# EAGLE schematic meArm (EAGLE 7.6.0)
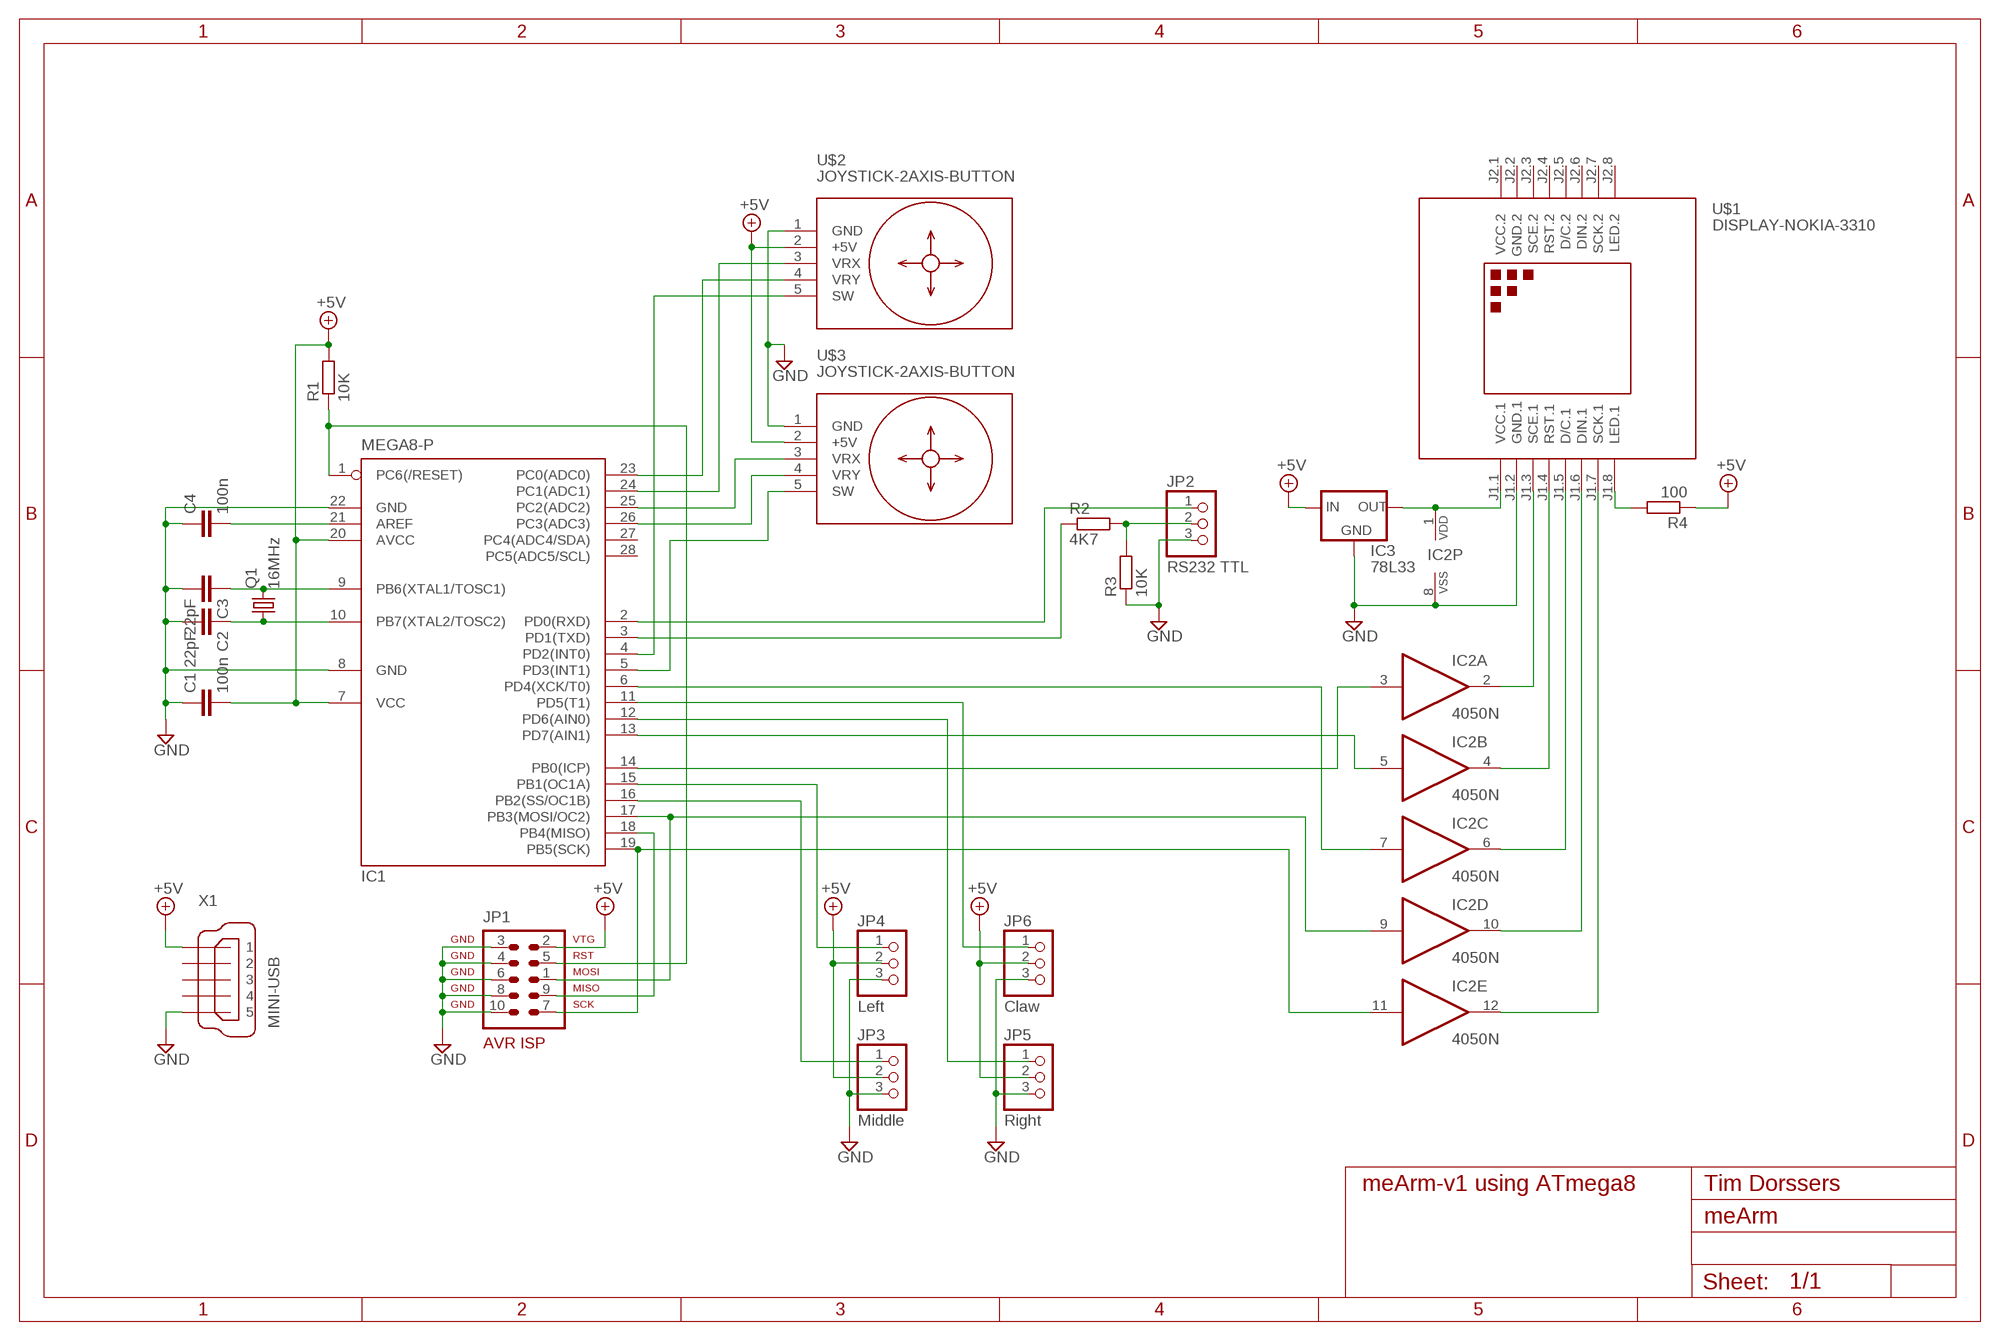
[diagram p0: schematic, sheet 1]

## Parts
C1  100n  C-EU025-025X050  [C025-025X050]
C2  22pF  C-EU025-024X044  [C025-024X044]
C3  22pF  C-EU025-024X044  [C025-024X044]
C4  100n  C-EU025-025X050  [C025-025X050]
IC1  MEGA8-P  [DIL28-3]
IC2  4050N  [DIL16]
IC3  78L33  78LXX  [78LXX]
JP1  AVR-ISP-10  [AVR-ISP-10]
JP2  RS232 TTL  PINHD-1X3  [1X03]
JP3  Middle  PINHD-1X3  [1X03]
JP4  Left  PINHD-1X3  [1X03]
JP5  Right  PINHD-1X3  [1X03]
JP6  Claw  PINHD-1X3  [1X03]
Q1  16MHz  CRYSTALHC49U-V  [HC49U-V]
R1  10K  R-EU_0204/7  [0204/7]
R2  4K7  R-EU_0204/7  [0204/7]
R3  10K  R-EU_0204/7  [0204/7]
R4  100  R-EU_0204/7  [0204/7]
U$1  DISPLAY-NOKIA-3310  [DISPLAY-NOKIA-3310]
U$2  JOYSTICK-2AXIS-BUTTON  [JOYSTICK-2AXIS-BUTTON]
U$3  JOYSTICK-2AXIS-BUTTON  [JOYSTICK-2AXIS-BUTTON]
X1  MINI-USB  MINI-USB_SHIELD5P2-32005-601  [32005-601]

## Nets
+5V: C1.2 IC1.7(VCC) IC1.20(AVCC) IC3.IN JP1.2 JP3.2 JP4.2 JP5.2 JP6.2 R1.2 R4.1 U$2.2(+5V) U$3.2(+5V) X1.1
GND: C1.1 C2.2 C3.2 C4.1 IC1.8(GND) IC1.22(GND) IC2.8(P:VSS) IC3.GND JP1.3 JP1.4 JP1.6 JP1.8 JP1.10 JP2.3 JP3.3 JP4.3 JP5.3 JP6.3 R3.1 U$1.J1.2(GND.1) U$2.1(GND) U$3.1(GND) X1.5
N$1: IC1.19(PB5(SCK)) IC2.11(E:I) JP1.7
N$2: IC2.1(P:VDD) IC3.OUT U$1.J1.1(VCC.1)
N$3: IC1.18(PB4(MISO)) JP1.9
N$4: IC1.17(PB3(MOSI/OC2)) IC2.9(D:I) JP1.1
N$5: R4.2 U$1.J1.8(LED.1)
N$6: IC2.2(A:O) U$1.J1.3(SCE.1)
N$7: IC2.4(B:O) U$1.J1.4(RST.1)
N$8: IC2.6(C:O) U$1.J1.5(D/C.1)
N$9: IC2.10(D:O) U$1.J1.6(DIN.1)
N$10: IC2.12(E:O) U$1.J1.7(SCK.1)
N$11: IC1.23(PC0(ADC0)) U$2.4(VRY)
N$12: IC1.24(PC1(ADC1)) U$2.3(VRX)
N$13: IC1.25(PC2(ADC2)) U$3.3(VRX)
N$14: IC1.26(PC3(ADC3)) U$3.4(VRY)
N$15: IC1.2(PD0(RXD)) JP2.1
N$16: IC1.3(PD1(TXD)) R2.1
N$17: IC1.4(PD2(INT0)) U$2.5(SW)
N$18: IC1.5(PD3(INT1)) U$3.5(SW)
N$19: IC1.1(PC6(/RESET)) JP1.5 R1.1
N$20: C3.1 IC1.9(PB6(XTAL1/TOSC1)) Q1.2
N$21: C2.1 IC1.10(PB7(XTAL2/TOSC2)) Q1.1
N$22: C4.2 IC1.21(AREF)
N$23: IC1.6(PD4(XCK/T0)) IC2.7(C:I)
N$24: IC1.13(PD7(AIN1)) IC2.5(B:I)
N$25: IC1.15(PB1(OC1A)) JP4.1
N$26: IC1.16(PB2(SS/OC1B)) JP3.1
N$27: IC1.14(PB0(ICP)) IC2.3(A:I)
N$28: IC1.11(PD5(T1)) JP6.1
N$29: IC1.12(PD6(AIN0)) JP5.1
N$49: JP2.2 R2.2 R3.2
Unconnected: IC1.27(PC4(ADC4/SDA)) IC1.28(PC5(ADC5/SCL)) IC2.14(F:I) IC2.15(F:O) U$1.J2.3(SCE.2) U$1.J2.4(RST.2) U$1.J2.5(D/C.2) U$1.J2.6(DIN.2) U$1.J2.7(SCK.2) U$1.J2.8(LED.2) X1.2 X1.3 X1.4 X1.M1(S1) X1.M2(S2)

## Notes on the sheet
- meArm-v1 using ATmega8 | Tim Dorssers

## Power pins joined to a net without a drawn wire
GND.2: U$1.J2.2(GND.2)
VCC.2: U$1.J2.1(VCC.2)

## Library data of the parts
C1-C4 = rcl:C-EU: CAPACITOR, European symbol
IC1 = atmel:MEGA8-P: MICROCONTROLLER 8 Kbytes FLASH, 1 kbytes SRAM, 512 bytes EEPROM, USART, 4-channel 10 bit ADC, 2-channel 8 bit ADC Pin compatible with Atmega48, ATMega88, ATMega168 Source: avr.lbr
IC2 = 40xx:4050: Hex non-inverting BUFFER
IC3 = v-reg:78LXX: VOLTAGE REGULATOR
JP1 = avr-7:AVR-ISP-10: AVR ISP-10 Serial Programming Header
JP2-JP6 = pinhead:PINHD-1X3: PIN HEADER
Q1 = crystal:CRYSTAL: CRYSTAL
R1 = resistor:R-EU_: RESISTOR, European symbol
R2-R4 = rcl:R-EU_: RESISTOR, European symbol
U$1 = diy-modules:DISPLAY-NOKIA-3310: 84x48 Dot Matrix LCD Module based on Nokia 3310 display More details available here: https://arduinoandsoftware.wordpress.com/2012/12/30/nokia-33105110-3-3v-display-with-5v-arduino/
U$2 U$3 = diy-modules:JOYSTICK-2AXIS-BUTTON: 2-Axis Analog Joystick with Push Button Tutorial is available here: http://henrysbench.capnfatz.com/henrys-bench/arduino-sensors-and-input/arduino-ps2-joystick-tutorial-keyes-ky-023-deek-robot/ Click here to find device on ebay.com <http://www.ebay.com/sch/joystick+ps2+module>
X1 = con-cypressindustries:MINI-USB_SHIELD5P2-: MINI USB-B R/A DIP 5pol. Source: www.cypressindustries.com; OC_FARNELL: unknown; OC_NEWARK: unknown